# Altium schematic sheet BOOT.SchDoc
size 149 x 100 mm
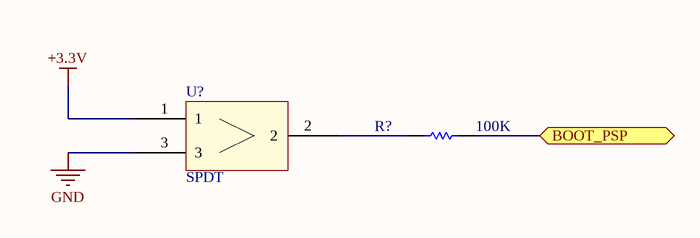
[diagram p0: BOOT.SchDoc]

## Parts
R?  value 100K  [AXIAL-0.3]  (hidden comment: Res1)
U?  SPDT

## Ports
BOOT_PSP

## Nets
+3.3V: U?.1
GND: U?.3
BOOT_PSP: R?.1 ; port BOOT_PSP
NetR?_2: R?.2 U?.2

## Library data of the parts
R? = Res1: Resistor
U? = SPDT: Commutateur à glissière; Fabricant: C & K COMPONENTS; Fournisseur: Farnell; RefFabricant: OS102011MS2QN1C; RefFournisseur: 2435104